# Altium schematic sheet Button.SchDoc
size A
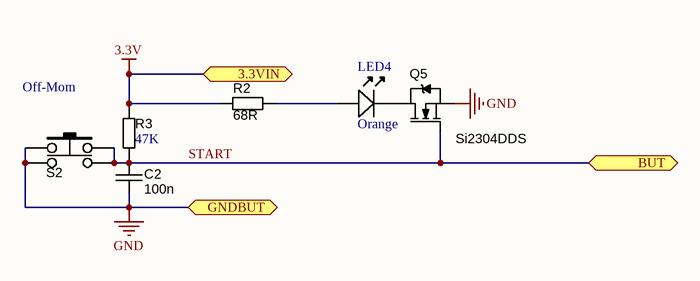
[diagram p0: Button.SchDoc]

## Parts
C2  value 100n  [CAPC1608X90N]  (hidden comment: approved sub OK)
LED4  Color: Orange  [LED-0603-AMBER]  (hidden comment: LO L296-Q2S1-24-Z)
Q5  Si2304DDS  [SOT23-3]
R2  value 68R  [RESC1608X55N]  (hidden comment: Thick Film)
R3  value 47K  [RESC1608X55N]  (hidden comment: Thick Film)
S2  Switch Function: Off-Mom  [SW_PVA1]  (hidden comment: SW_NO_MOM_PVA1 OA H1 1.2N V2)

## Ports
3.3VIN, BUT, GNDBUT

## Nets
3.3V: R2.1 R3.1 ; port 3.3VIN
GND: C2.2 Q5.2(S) S2.1 S2.1' ; port GNDBUT
START: C2.1 Q5.1(G) R3.2 S2.2 S2.2' ; port BUT
NetLED4_A: LED4.A R2.2
NetLED4_K: LED4.K Q5.3(D)

## Library data of the parts
C2 = CAPC_100n_0603_X7R_50V_10%: Capacitor SMD Cer 100nF 10% 50V X7R 0603; Manufacturer: Murata Electronics North America; Manufacturer Part Number: GRM188R71H104KA93D; Tolerance: ±10%; Supplier 1: Digi-Key; Supplier Part Number 1: 490-1519-1-ND; RoHS: RoHS Compliant; Category: Capacitors; Stock 1: 21293840; Pricing 1: 1=0.12, 10=0.084, 100=0.0396, 500=0.02778, 1000=0.023 (USD); Packaging: Cut Tape (CT); Part Status: Active; Voltage - Rated: 50V; Temperature Coefficient: X7R; Operating Temperature: -55°C ~ 125°C; Features: -; Ratings: -; Applications: General Purpose; Mounting Type: Surface Mount, MLCC; Package / Case: 0603 (1608 Metric); Size / Dimension: 0.063" L x 0.031" W (1.60mm x 0.80mm); Height - Seated (Max): -; Thickness (Max): 0.035" (0.90mm); Lead Spacing: -; Lead Style: -; ComponentLink1URL: http://www.murata.com/~/media/webrenewal/support/library/catalog/products/capacitor/mlcc/c02e.pdf; ComponentLink1Description: http://www.murata.com/~/media/webrenewal/support/library/catalog/products/capacitor/mlcc/c02e.pdf
LED4 = LED_0603_Orange: LED ORANGE DIFFUSED 0603 SMD; Manufacturer: OSRAM Opto Semiconductors Inc.; Lens Color: White; Millicandela Rating: 157mcd; Lens Style/Size: Rectangle with Flat Top, 1.30mm x 0.80mm; Voltage - Forward (Vf) (Typ): 2V; Current - Test: 20mA; Viewing Angle: 160°; Wavelength - Dominant: 605nm; Supplier 1: Digi-Key; Manufacturer Part Number: LO L296-Q2S1-24-Z; Packaging: Cut Tape (CT); Part Status: Active; Lens Transparency: Diffused; Mounting Type: Surface Mount; Wavelength - Peak: -; Features: -; Package / Case: 0603 (1608 Metric); Size / Dimension: 1.70mm L x 0.80mm W; Height (Max): 0.65mm; ComponentLink1URL: http://www.osram-os.com/Graphics/XPic9/00077122_0.pdf; ComponentLink1Description: http://www.osram-os.com/Graphics/XPic9/00077122_0.pdf; Supplier Part Number 1: 475-2739-1-ND; RoHS: RoHS Compliant; Category: Optoelectronics; Stock 1: 4435; Pricing 1: 1=0.34, 10=0.245, 25=0.2004, 100=0.1603, 250=0.13524, 500=0.11522, 1000=0.09017, 2500=0.08349 (USD)
Q5 = MOSFET_Si2304DDS: MOSFET SMD N-CH 30V 3.6A 1.7W SOT23-3; Material: Metal Oxide; SCDType: source; Ratings: 30V; 3.6A; Package / Case: SOT23-3; Supplier 1: Digi-Key; Supplier Part Number 1: SI2304DDS-T1-GE3CT-ND
R2 = RES_68R_0603_5%: Resistor SMD chip 68 Ohm 0.1W 5% 0603; Manufacturer 1: Yageo; Manufacturer Part Number 1: RC0603JR-0768RL; Ratings: 1/10 W; SCDType: spec; Package / Case: 0603 (1608 metric); Tolerance: ±5%; Material: Thick Film; Supplier 1: Digi-Key; Supplier Part Number 1: 311-68GRCT-ND
R3 = RES_47K_0603_1%: Resistor SMD chip 47k Ohm 0.1W 1% 0603; Manufacturer 1: Panasonic Electronic Components; Manufacturer Part Number 1: ERJ-3EKF4702V; Description 1: RES SMD 47K OHM 1% 1/10W 0603; Power (Watts): 0.1W, 1/10W; Temperature Coefficient: ±100ppm/°C; Supplier 1: Digi-Key; Supplier Part Number 1: P47.0KHCT-ND; RoHS: RoHS Compliant; Category: Resistors; Stock 1: 1463956; Pricing 1: 1=0.1, 10=0.021, 100=0.0087, 1000=0.00389, 2500=0.00338 (USD); Packaging: Cut Tape (CT); Part Status: Active; Tolerance: ±1%; Composition: Thick Film; Features: Automotive AEC-Q200; Operating Temperature: -55°C ~ 155°C; Package / Case: 0603 (1608 Metric); Supplier Device Package: 0603; Size / Dimension: 0.063" L x 0.032" W (1.60mm x 0.80mm); Height - Seated (Max): 0.022" (0.55mm); Failure Rate: -; ComponentLink1URL: https://industrial.panasonic.com/cdbs/www-data/pdf/RDA0000/AOA0000C304.pdf; ComponentLink1Description: https://industrial.panasonic.com/cdbs/www-data/pdf/RDA0000/AOA0000C304.pdf
S2 = SW_NO_MOM_PVA1OAH11.2NV2: Low-profile captive tact switch; Manufacturer: C&K; Circuit: DPST-NO; Current Rating: 100mA (DC); Actuator Type: Plunger for Cap; Color - Actuator/Cap: White; Electrical Life: 100,000 Cycles; Supplier 1: Digi-Key; Supplier Part Number 1: 401-1133-ND; RoHS: RoHS Compliant; Category: Switches; Stock 1: 28581; Pricing 1: 1=1.23, 10=1.145, 25=1.09, 50=1.0356, 100=1.0083, 250=0.981, 500=0.9265, 1000=0.872, 5000=0.73575 (USD); Packaging: Bulk; Part Status: Active; Type: Keyswitch; Illumination Type, Color: -; Illumination Voltage (Nominal): -; Mounting Type: Through Hole; Termination Style: PC Pin; Ingress Protection: -; Features: -; Panel Cutout Dimensions: -; Operating Temperature: -40°C ~ 85°C; Mechanical Life: -; ComponentLink1URL: http://www.ckswitches.com/media/1343/pva.pdf; ComponentLink1Description: http://www.ckswitches.com/media/1343/pva.pdf; Manufacturer Part Number: PVA1 OA H1 1.2N V2